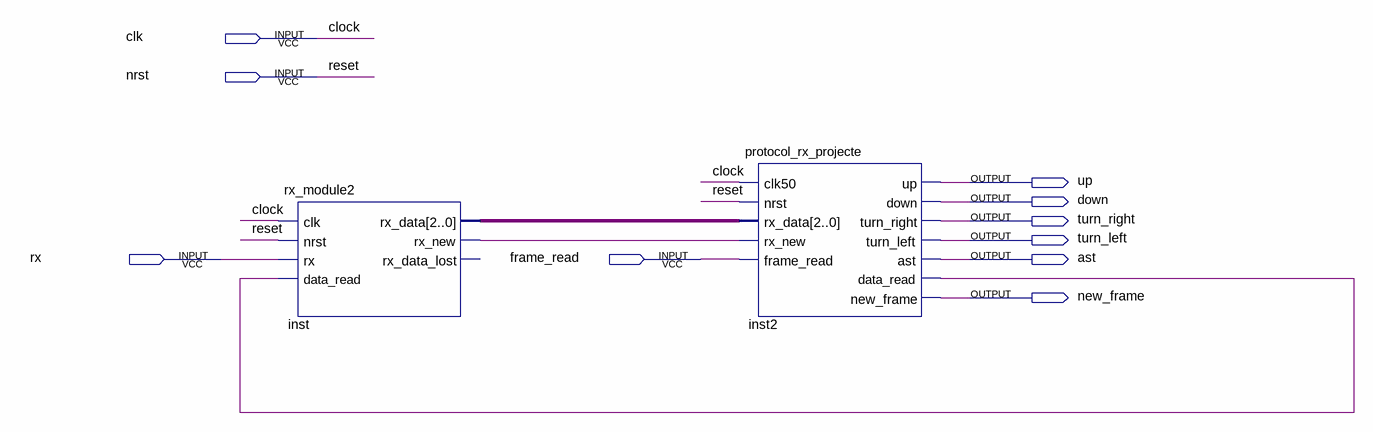
[diagram p0: schematic sheet]
// Quartus schematic reception.bdf as structural Verilog: 2 symbols, 10 pins
module reception (
  input  clk,
  input  nrst,
  input  rx,
  input  frame_read,
  output up,
  output down,
  output turn_right,
  output turn_left,
  output ast,
  output new_frame
);

  wire inst2_data_read, inst_rx_new;
  wire [2:0] inst_rx_data;

  rx_module2 inst (
    .clk(clk), .nrst(nrst), .rx(rx), .data_read(inst2_data_read), .rx_data(inst_rx_data), .rx_new(inst_rx_new));  // open: rx_data_lost
  protocol_rx_projecte inst2 (
    .clk50(clk), .nrst(nrst), .rx_data(inst_rx_data), .rx_new(inst_rx_new), .frame_read(frame_read), .up(up),
    .down(down), .turn_right(turn_right), .turn_left(turn_left), .ast(ast), .data_read(inst2_data_read),
    .new_frame(new_frame));

  // Other names for the same wires on the sheet: clock = clk; reset = nrst
endmodule
